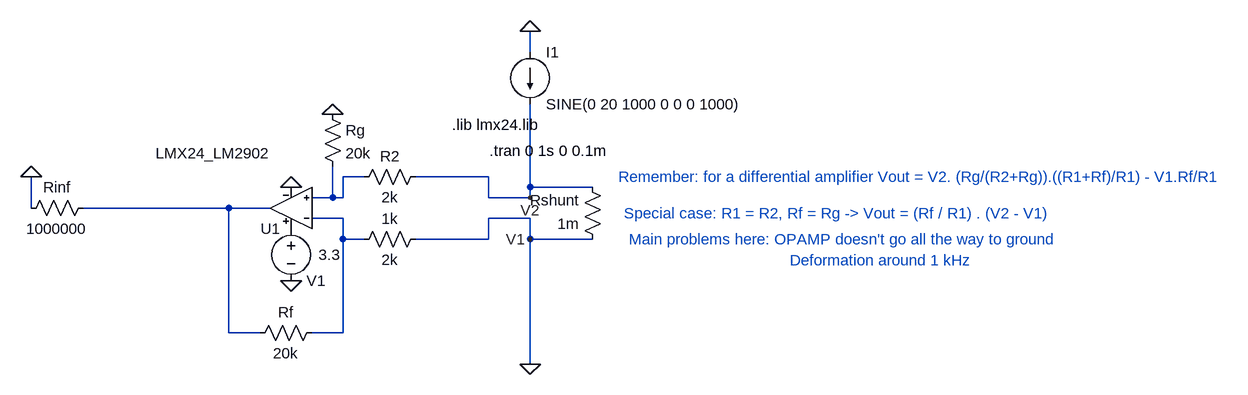
[diagram p0: schematic current_meas_lmx24.asc]
current_meas_lmx24.asc, the LTspice schematic file:
Version 4
SHEET 1 1080 680
WIRE -112 -112 -112 -144
WIRE -368 80 -400 80
WIRE -176 80 -288 80
WIRE -112 96 -112 -32
WIRE -16 96 -112 96
WIRE -416 112 -416 64
WIRE -416 112 -448 112
WIRE -400 112 -400 80
WIRE -400 112 -416 112
WIRE -176 112 -176 80
WIRE -112 112 -112 96
WIRE -112 112 -176 112
WIRE -880 128 -880 80
WIRE -576 128 -800 128
WIRE -512 128 -576 128
WIRE -400 144 -448 144
WIRE -112 144 -176 144
WIRE -400 176 -400 144
WIRE -368 176 -400 176
WIRE -176 176 -176 144
WIRE -176 176 -288 176
WIRE -112 176 -112 144
WIRE -16 176 -112 176
WIRE -576 320 -576 128
WIRE -528 320 -576 320
WIRE -400 320 -400 176
WIRE -400 320 -448 320
WIRE -112 368 -112 176
FLAG -112 -144 0
FLAG -112 368 0
FLAG -880 80 0
FLAG -480 96 0
FLAG -480 240 0
FLAG -416 -16 0
FLAG -112 176 V1
FLAG -112 112 V2
SYMBOL OpAmps\\lmx24 -480 192 R180
WINDOW 3 31 148 Left 2
SYMATTR Value LMX24_LM2902
SYMATTR InstName U1
SYMATTR Prefix ""
SYMBOL current -112 -112 R0
WINDOW 123 0 0 Left 0
WINDOW 39 0 0 Left 0
SYMATTR InstName I1
SYMATTR Value SINE(0 20 1000 0 0 0 1000)
SYMBOL res 0 192 R180
WINDOW 0 36 76 Left 2
WINDOW 3 36 40 Left 2
SYMATTR InstName Rshunt
SYMATTR Value 1m
SYMBOL res -896 144 R270
WINDOW 0 32 56 VTop 2
WINDOW 3 0 56 VBottom 2
SYMATTR InstName Rinf
SYMATTR Value 1000000
SYMBOL voltage -480 144 R0
WINDOW 0 24 96 Left 2
WINDOW 3 42 56 Left 2
WINDOW 123 0 0 Left 0
WINDOW 39 0 0 Left 0
SYMATTR InstName V1
SYMATTR Value 3.3
SYMBOL res -272 64 R90
WINDOW 0 0 56 VBottom 2
WINDOW 3 32 56 VTop 2
SYMATTR InstName R2
SYMATTR Value 2k
SYMBOL res -272 160 R90
WINDOW 0 0 56 VBottom 2
WINDOW 3 32 56 VTop 2
SYMATTR InstName 1k
SYMATTR Value 2k
SYMBOL res -432 304 R90
WINDOW 0 0 56 VBottom 2
WINDOW 3 32 56 VTop 2
SYMATTR InstName Rf
SYMATTR Value 20k
SYMBOL res -432 -32 R0
SYMATTR InstName Rg
SYMATTR Value 20k
TEXT 8 40 Right 2 !.tran 0 1s 0 0.1m
TEXT -232 0 Left 2 !.lib lmx24.lib
TEXT 24 80 Left 2 ;Remember: for a differential amplifier Vout = V2. (Rg/(R2+Rg)).((R1+Rf)/R1) - V1.Rf/R1
TEXT 32 136 Left 2 ;Special case: R1 = R2, Rf = Rg -> Vout = (Rf / R1) . (V2 - V1)
TEXT 40 176 Left 2 ;Main problems here: OPAMP doesn't go all the way to ground
TEXT 288 208 Left 2 ;Deformation around 1 kHz

The netlist it stands for:
* current_meas_lmx24.asc
XU1 N001 N003 P001 0 N002 LMX24_LM2902  ; pins IN+ IN- VCC VEE OUT
I1 0 V2 SINE(0 20 1000 0 0 0 1000)
Rshunt 0 V2 1m
Rinf 0 N002 1000000
V1 P001 0 3.3
R2 V2 N001 2k
R§1k 0 N003 2k
Rf N003 N002 20k
Rg 0 N001 20k
.tran 0 1s 0 0.1m
.lib lmx24.lib
* Remember: for a differential amplifier Vout = V2. (Rg/(R2+Rg)).((R1+Rf)/R1) - V1.Rf/R1
* Special case: R1 = R2, Rf = Rg -> Vout = (Rf / R1) . (V2 - V1)
* Main problems here: OPAMP doesn't go all the way to ground
* Deformation around 1 kHz
.backanno
.end